# EAGLE design T08_rc360detector_final (EAGLE 7.4.0)
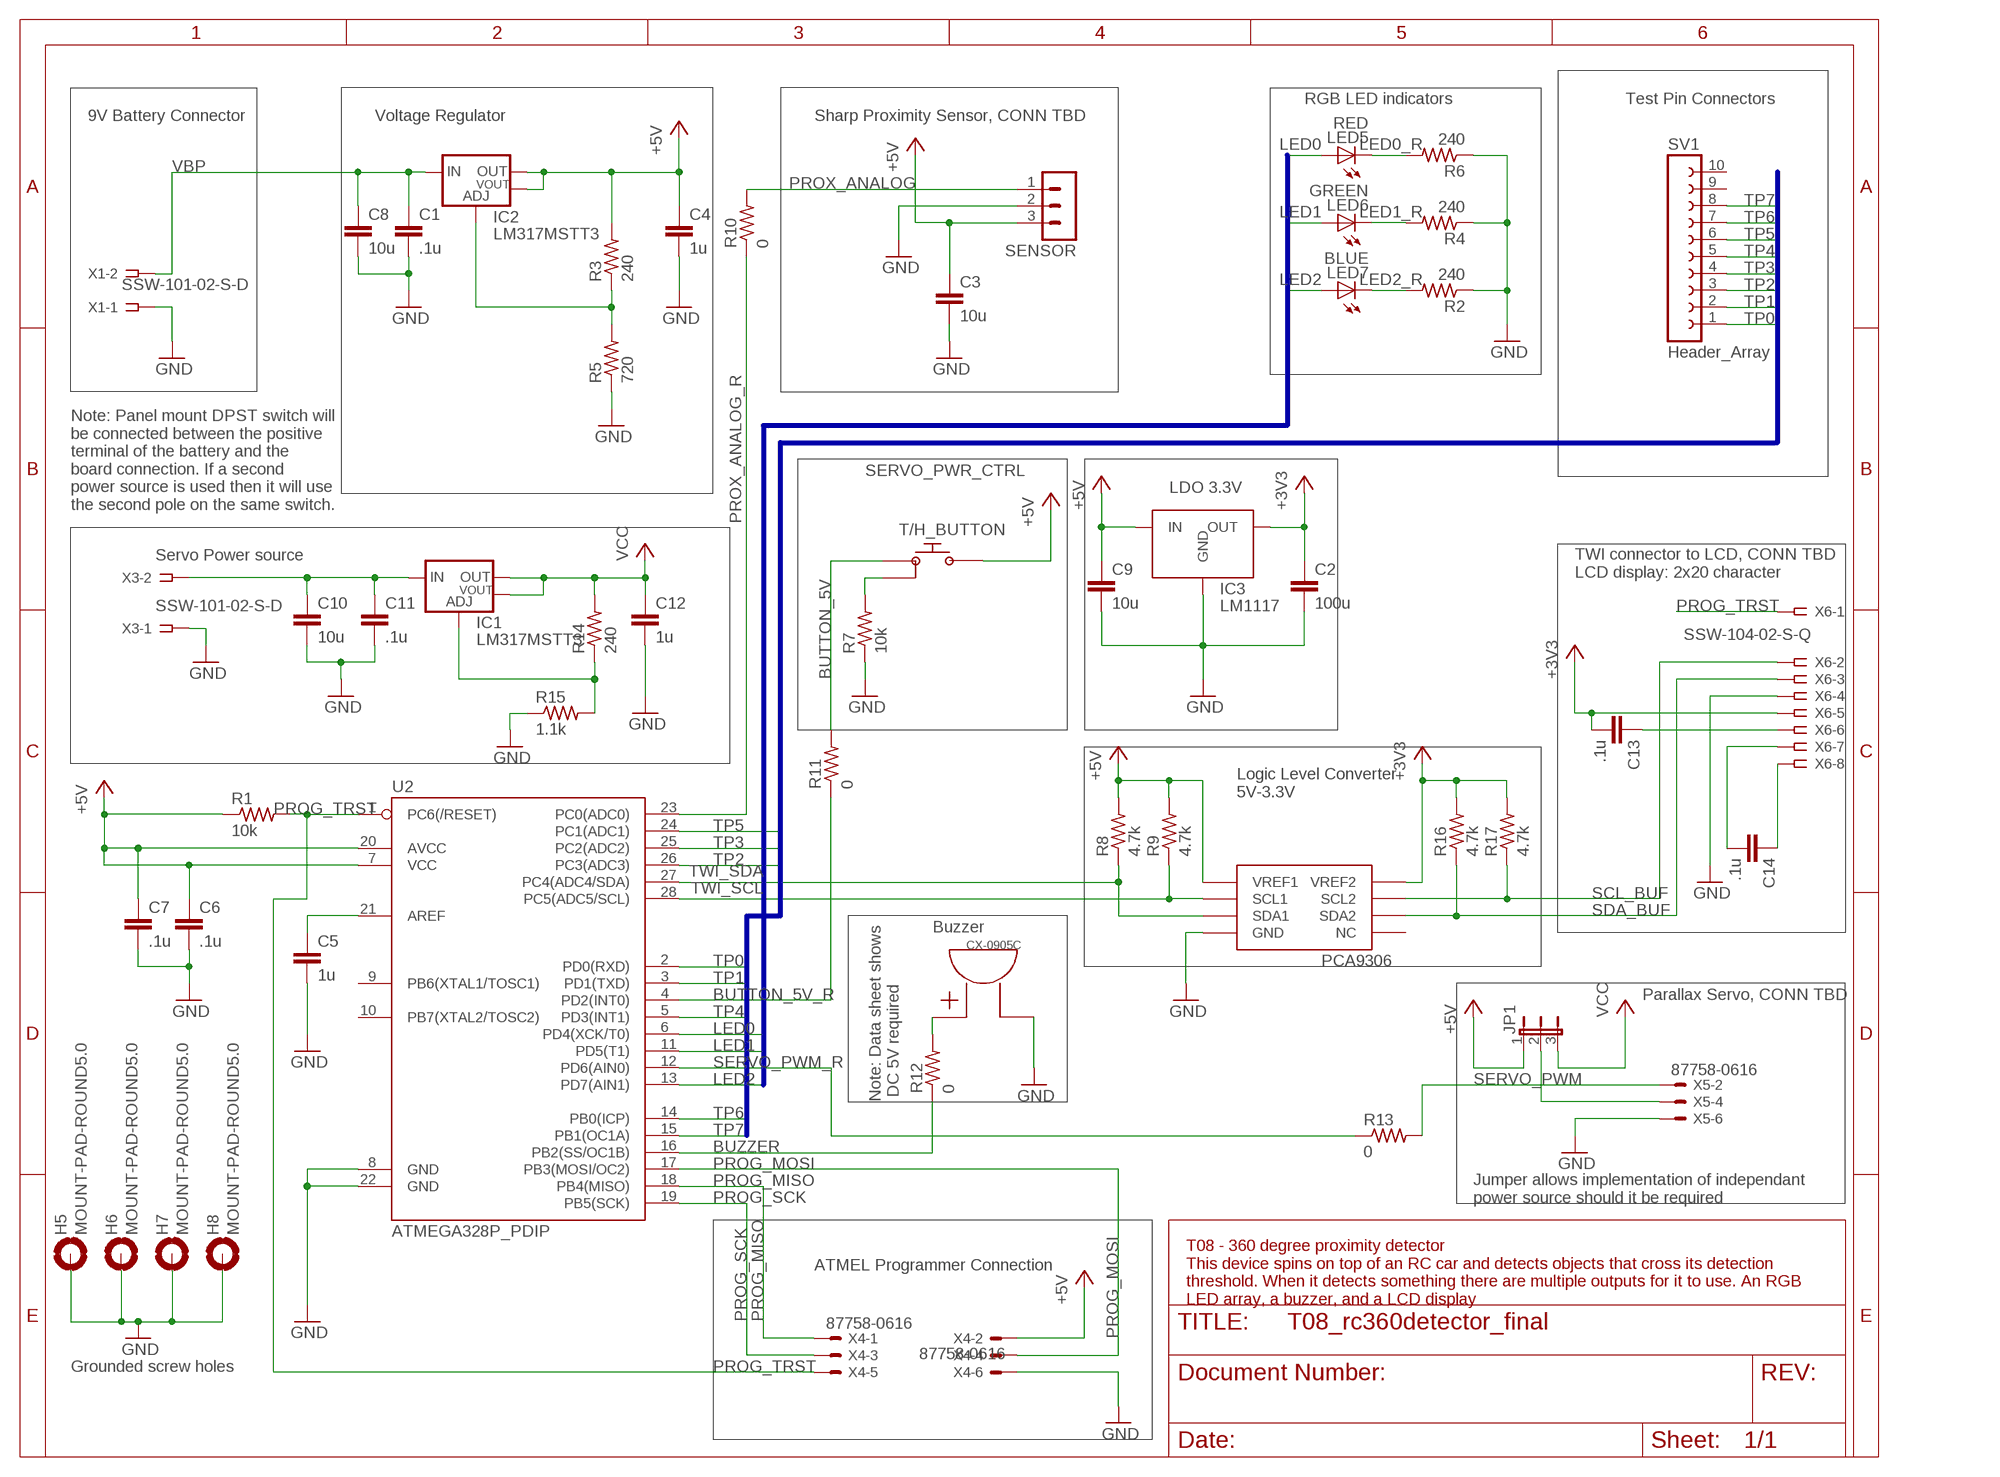
[diagram p0: schematic, sheet 1]

## Parts
C1  .1u  C-EUC0805  [C0805]
C2  100u  C-EUC0805  [C0805]
C3  10u  C-EUC0805  [C0805]
C4  1u  C-EUC0805  [C0805]
C5  1u  C-EUC0805  [C0805]
C6  .1u  C-EUC0805  [C0805]
C7  .1u  C-EUC0805  [C0805]
C8  10u  C-EUC0805  [C0805]
C9  10u  C-EUC0805  [C0805]
C10  10u  C-EUC0805  [C0805]
C11  .1u  C-EUC0805  [C0805]
C12  1u  C-EUC0805  [C0805]
C13  .1u  C-EUC0805  [C0805]
C14  .1u  C-EUC0805  [C0805]
CX-0905C  CX-0905C  [BUZZER_CX-0905C]
H5  MOUNT-PAD-ROUND5.0  [5,0-PAD]
H6  MOUNT-PAD-ROUND5.0  [5,0-PAD]
H7  MOUNT-PAD-ROUND5.0  [5,0-PAD]
H8  MOUNT-PAD-ROUND5.0  [5,0-PAD]
IC1  LM317MSTT3  [SOT223]
IC2  LM317MSTT3  [SOT223]
IC3  LM1117  [SOT-223]
JP1  JP2E  [JP2]
LED5  RED  LEDLD260  [LD260]
LED6  GREEN  LEDLD260  [LD260]
LED7  BLUE  LEDLD260  [LD260]
PCA9306  PCA9306_BREAKOUT  [PCA9306_BREAKOUT]
R1  10k  R-US_R0805  [R0805]
R2  240  R-US_R0805  [R0805]
R3  240  R-US_R0805  [R0805]
R4  240  R-US_R0805  [R0805]
R5  720  R-US_R0805  [R0805]
R6  240  R-US_R0805  [R0805]
R7  10k  R-US_R0805  [R0805]
R8  4.7k  R-US_R0805  [R0805]
R9  4.7k  R-US_R0805  [R0805]
R10  0  R-US_R0805  [R0805]
R11  0  R-US_R0805  [R0805]
R12  0  R-US_R0805  [R0805]
R13  0  R-US_R0805  [R0805]
R14  240  R-US_R0805  [R0805]
R15  1.1k  R-US_R0805  [R0805]
R16  4.7k  R-US_R0805  [R0805]
R17  4.7k  R-US_R0805  [R0805]
SENSOR  MA03-1  [MA03-1]
SV1  Header_Array  FE10-1  [FE10]
T/H_BUTTON  PR141C  [3_THROUGH_HOLE]
U2  ATMEGA328P_PDIP  [DIL28-3]
X1  SSW-101-02-S-D  [SSW-101-02-S-D]
X3  SSW-101-02-S-D  [SSW-101-02-S-D]
X4  87758-0616  [87758-0616]
X5  87758-0616  [87758-0616]
X6  SSW-104-02-S-Q  [SSW-104-02-S-Q]

## Nets
+3V3: C2.1 C13.2 IC3.VOUT(OUT) PCA9306.VREF2 R16.2 R17.2 X6.5
+5V: C3.1 C4.1 C6.1 C7.1 C9.1 IC2.2(VOUT) IC2.4(OUT) IC3.IN JP1.1 PCA9306.VREF1 R1.1 R3.2 R8.2 R9.2 SENSOR.3 T/H_BUTTON.P$3(OUT) U2.7(VCC) U2.20(AVCC) X4.2
AREF: C5.1 U2.21(AREF)
BUTTON_5V: R11.2 T/H_BUTTON.P$1(IN)
BUTTON_5V_R: R11.1 U2.4(PD2(INT0))
BUZZER: R12.1 U2.16(PB2(SS/OC1B))
GND: C1.2 C2.2 C3.2 C4.2 C5.2 C6.2 C7.2 C8.2 C9.2 C10.2 C11.2 C12.2 CX-0905C.OUT H5.B5(MOUNT) H6.B5(MOUNT) H7.B5(MOUNT) H8.B5(MOUNT) IC3.GND PCA9306.GND R2.1 R4.1 R5.1 R6.1 R7.1 R15.1 SENSOR.2 U2.8(GND) U2.22(GND) X1.1 X3.1 X4.6 X5.6 X6.4
LED0: LED5.A U2.6(PD4(XCK/T0))
LED0_R: LED5.K(C) R6.2
LED1: LED6.A U2.11(PD5(T1))
LED1_R: LED6.K(C) R4.2
LED2: LED7.A U2.13(PD7(AIN1))
LED2_R: LED7.K(C) R2.2
N$1: R7.2 T/H_BUTTON.P$2(GND)
N$2: IC2.1(ADJ) R3.1 R5.2
N$4: CX-0905C.IN R12.2
N$13: IC1.1(ADJ) R14.1 R15.2
N$14: C10.1 C11.1 IC1.3(IN) X3.2
N$16: JP1.2 X5.4
N$18: C13.1 X6.6
N$19: C14.2 X6.7
N$20: C14.1 X6.8
PROG_MISO: U2.18(PB4(MISO)) X4.1
PROG_MOSI: U2.17(PB3(MOSI/OC2)) X4.4
PROG_SCK: U2.19(PB5(SCK)) X4.3
PROG_TRST: R1.2 U2.1(PC6(/RESET)) X4.5 X6.1
PROX_ANALOG: R10.2 SENSOR.1
PROX_ANALOG_R: R10.1 U2.23(PC0(ADC0))
SCL_BUF: PCA9306.SCL2 R17.1 X6.2
SDA_BUF: PCA9306.SDA2 R16.1 X6.3
SERVO_PWM: R13.2 X5.2
SERVO_PWM_R: R13.1 U2.12(PD6(AIN0))
TP0: SV1.1 U2.2(PD0(RXD))
TP1: SV1.2 U2.3(PD1(TXD))
TP2: SV1.3 U2.26(PC3(ADC3))
TP3: SV1.4 U2.25(PC2(ADC2))
TP4: SV1.5 U2.5(PD3(INT1))
TP5: SV1.6 U2.24(PC1(ADC1))
TP6: SV1.7 U2.14(PB0(ICP))
TP7: SV1.8 U2.15(PB1(OC1A))
TWI_SCL: PCA9306.SCL1 R9.1 U2.28(PC5(ADC5/SCL))
TWI_SDA: PCA9306.SDA1 R8.1 U2.27(PC4(ADC4/SDA))
VBP: C1.1 C8.1 IC2.3(IN) X1.2
VCC: C12.1 IC1.2(VOUT) IC1.4(OUT) JP1.3 R14.2
Unconnected: PCA9306.NC SV1.9 SV1.10 U2.9(PB6(XTAL1/TOSC1)) U2.10(PB7(XTAL2/TOSC2)) X5.1 X5.3 X5.5

## Buses
LED[0..2]
TP[0..13]

## Notes on the sheet
- RGB LED indicators | Test Pin Connectors
- 9V Battery Connector | Voltage Regulator | Sharp Proximity Sensor, CONN TBD
- SERVO_PWR_CTRL
- LDO 3.3V
- Note: Panel mount DPST switch will
  be connected between the positive
  terminal of the battery and the 
  board connection. If a second 
  power source is used then it will use
  the second pole on the same switch.
- Servo Power source
- TWI connector to LCD, CONN TBD
  LCD display: 2x20 character
- Logic Level Converter
  5V-3.3V
- Buzzer
- Parallax Servo, CONN TBD
- Note: Data sheet shows
   DC 5V required
- Jumper allows implementation of independant 
  power source should it be required
- ATMEL Programmer Connection
- T08 - 360 degree proximity detector
  This device spins on top of an RC car and detects objects that cross its detection
  threshold. When it detects something there are multiple outputs for it to use. An RGB 
  LED array, a buzzer, and a LCD display
- Grounded screw holes

## Library data of the parts
C1 C4 C5 C9 C11-C14 = resistor:C-EU: CAPACITOR, European symbol
C2 C3 C6-C8 C10 = rcl:C-EU: CAPACITOR, European symbol
CX-0905C = 360prox:CX-0905C
H5-H8 = holes:MOUNT-PAD-ROUND: MOUNTING PAD, round
IC1 IC2 = v-reg:LM317?*: 500 mA Adjustable Output Positive Voltage Regulator Source: http://www.onsemi.co.jp .. LM317M-D.PDF
IC3 = 360prox:LM1117
JP1 = jumper:JP2E: JUMPER
LED5-LED7 = led:LED: LED OSRAM: - CHIPLED LG R971, LG N971, LY N971, LG Q971, LY Q971, LO R971, LY R971 LH N974, LH R974 LS Q976, LO Q976, LY Q976 LO Q996 - Hyper CHIPLED LW Q18S LB Q993, LB Q99A, LB R99A - SideLED LS A670, LO A670, LY A670, LG A670, LP A670 LB A673, LV A673, LT A673, LW A673 LH A674 LY A675 LS A676, LA A676, LO A676, LY A676, LW A676 LS A679, LY A679, LG A679 - Hyper Micro SIDELED® LS Y876, LA Y876, LO Y876, LY Y876 LT Y87S - SmartLED LW L88C, LW L88S LB L89C, LB L89S, LG L890 LS L89K, LO L89K, LY L89K LS L896, LA L896, LO L896, LY L896 - TOPLED LS T670, LO T670, LY T670, LG T670, LP T670 LSG T670, LSP T670, LSY T670, LOP T670, LYG T670 LG T671, LOG T671, LSG T671 LB T673, LV T673, LT T673, LW T673 LH T674 LS T676, LA T676, LO T676, LY T676, LB T676, LH T676, LSB T676, LW T676 LB T67C, LV T67C, LT T67C, LS T67K, LO T67K, LY T67K, LW E67C LS E67B, LA E67B, LO E67B, LY E67B, LB E67C, LV E67C, LT E67C LW T67C LS T679, LY T679, LG T679 LS T770, LO T770, LY T770, LG T770, LP T770 LB T773, LV T773, LT T773, LW T773 LH T774 LS E675, LA E675, LY E675, LS T675 LS T776, LA T776, LO T776, LY T776, LB T776 LHGB T686 LT T68C, LB T68C - Hyper Mini TOPLED® LB M676 - Mini TOPLED Santana® LG M470 LS M47K, LO M47K, LY M47K Source: http://www.osram.convergy.de LUXEON: - LUMILED® LXK2-PW12-R00, LXK2-PW12-S00, LXK2-PW14-U00, LXK2-PW14-V00 LXK2-PM12-R00, LXK2-PM12-S00, LXK2-PM14-U00 LXK2-PE12-Q00, LXK2-PE12-R00, LXK2-PE12-S00, LXK2-PE14-T00, LXK2-PE14-U00 LXK2-PB12-K00, LXK2-PB12-L00, LXK2-PB12-M00, LXK2-PB14-N00, LXK2-PB14-P00, LXK2-PB14-Q00 LXK2-PR12-L00, LXK2-PR12-M00, LXK2-PR14-Q00, LXK2-PR14-R00 LXK2-PD12-Q00, LXK2-PD12-R00, LXK2-PD12-S00 LXK2-PH12-R00, LXK2-PH12-S00 LXK2-PL12-P00, LXK2-PL12-Q00, LXK2-PL12-R00 Source: www.luxeon.com KINGBRIGHT: KA-3528ASYC Source: www.kingbright.com
PCA9306 = 360prox:PCA9306_BREAKOUT
R1-R17 = rcl:R-US_: RESISTOR, American symbol
SENSOR = con-lstb:MA03-1: PIN HEADER; OC_FARNELL: unknown; OC_NEWARK: unknown
SV1 = con-lsta:FE10-1: FEMALE HEADER; OC_FARNELL: unknown; OC_NEWARK: unknown
T/H_BUTTON = 360prox:PR141C
U2 = SparkFun-DigitalIC:ATMEGA328P_PDIP: uC used in the Arduino 32kb flash, 1k EEPROM, 2k SRAM This is the through-hole version of this chip.
X1 X3 = con-samtec:SSW-101-02-S-D: THROUGH-HOLE .025" SQ POST SOCKET Source: Samtec SSW.pdf; MPN: SSW-101-02-S-D; OC_FARNELL: unknown; OC_NEWARK: 82P1456
X4 X5 = con-molex:87758-0616: 6 Pin - 2mm Dual Row Single Wafer, Vertical T/H HDR Source: http://www.molex.com/pdm_docs/sd/877580616_sd.pdf; MPN: 87758-0616; OC_FARNELL: 7472323; OC_NEWARK: 25M5667
X6 = con-samtec:SSW-104-02-S-Q: THROUGH-HOLE .025" SQ POST SOCKET Source: Samtec SSW.pdf; MPN: SSW-104-02-S-Q; OC_FARNELL: unknown; OC_NEWARK: 82P2475

## Board
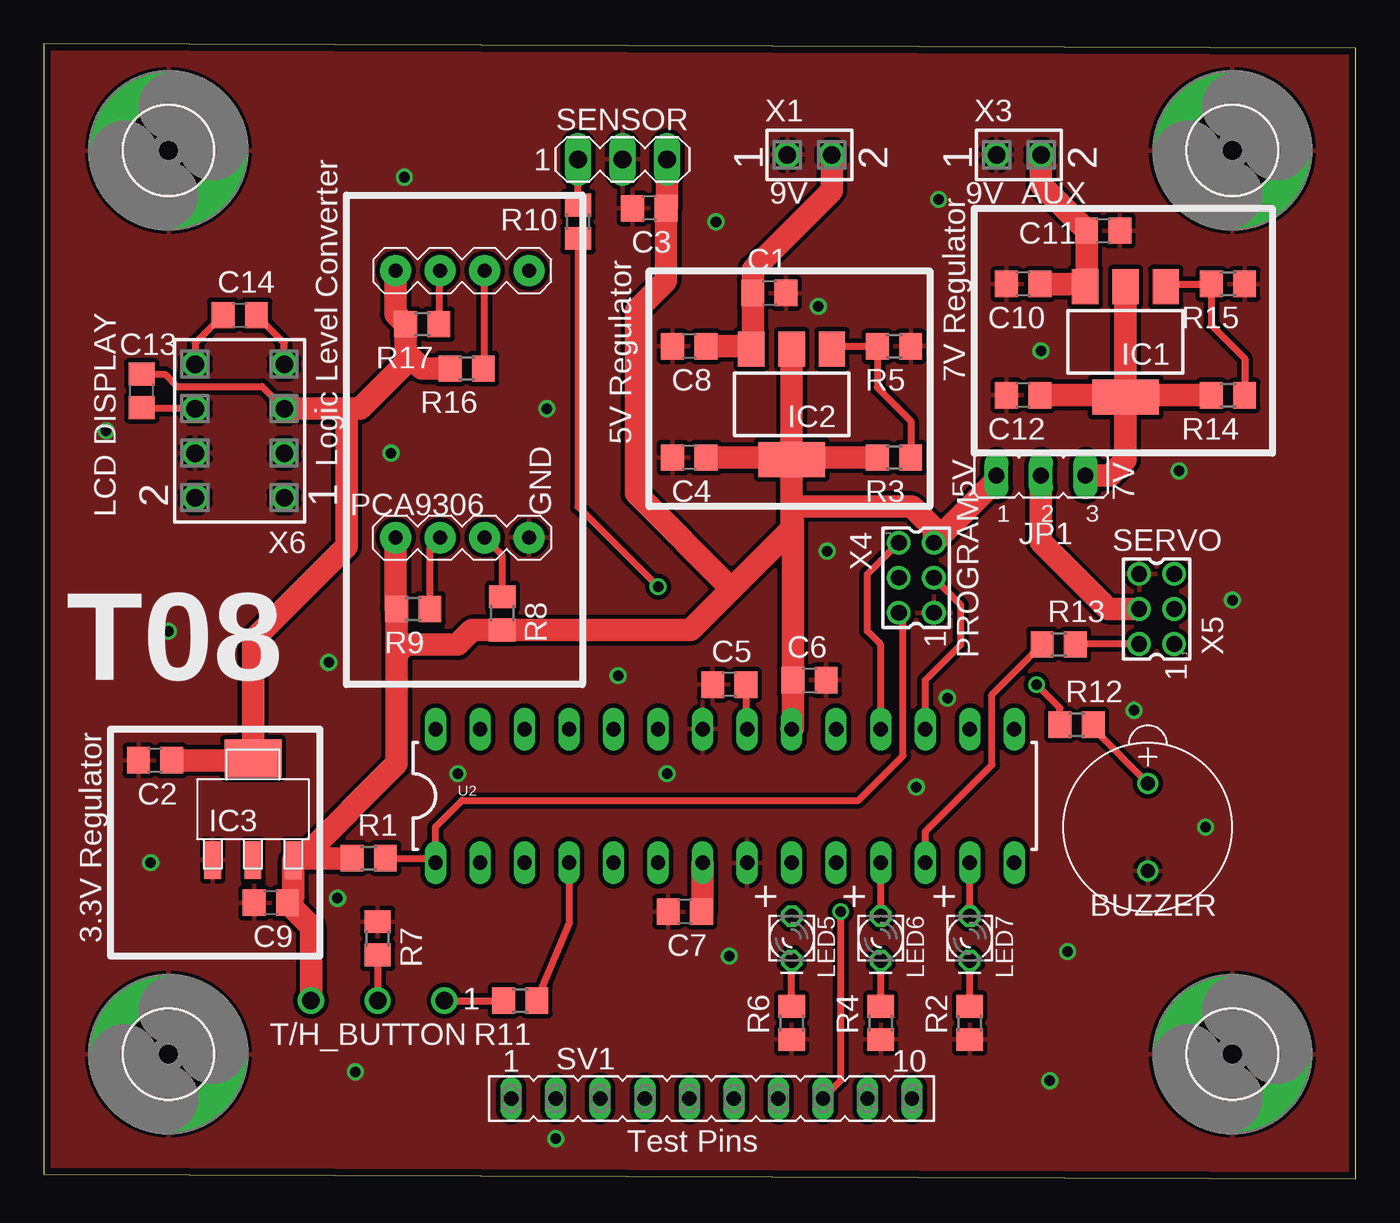
[diagram p1: board, top side]
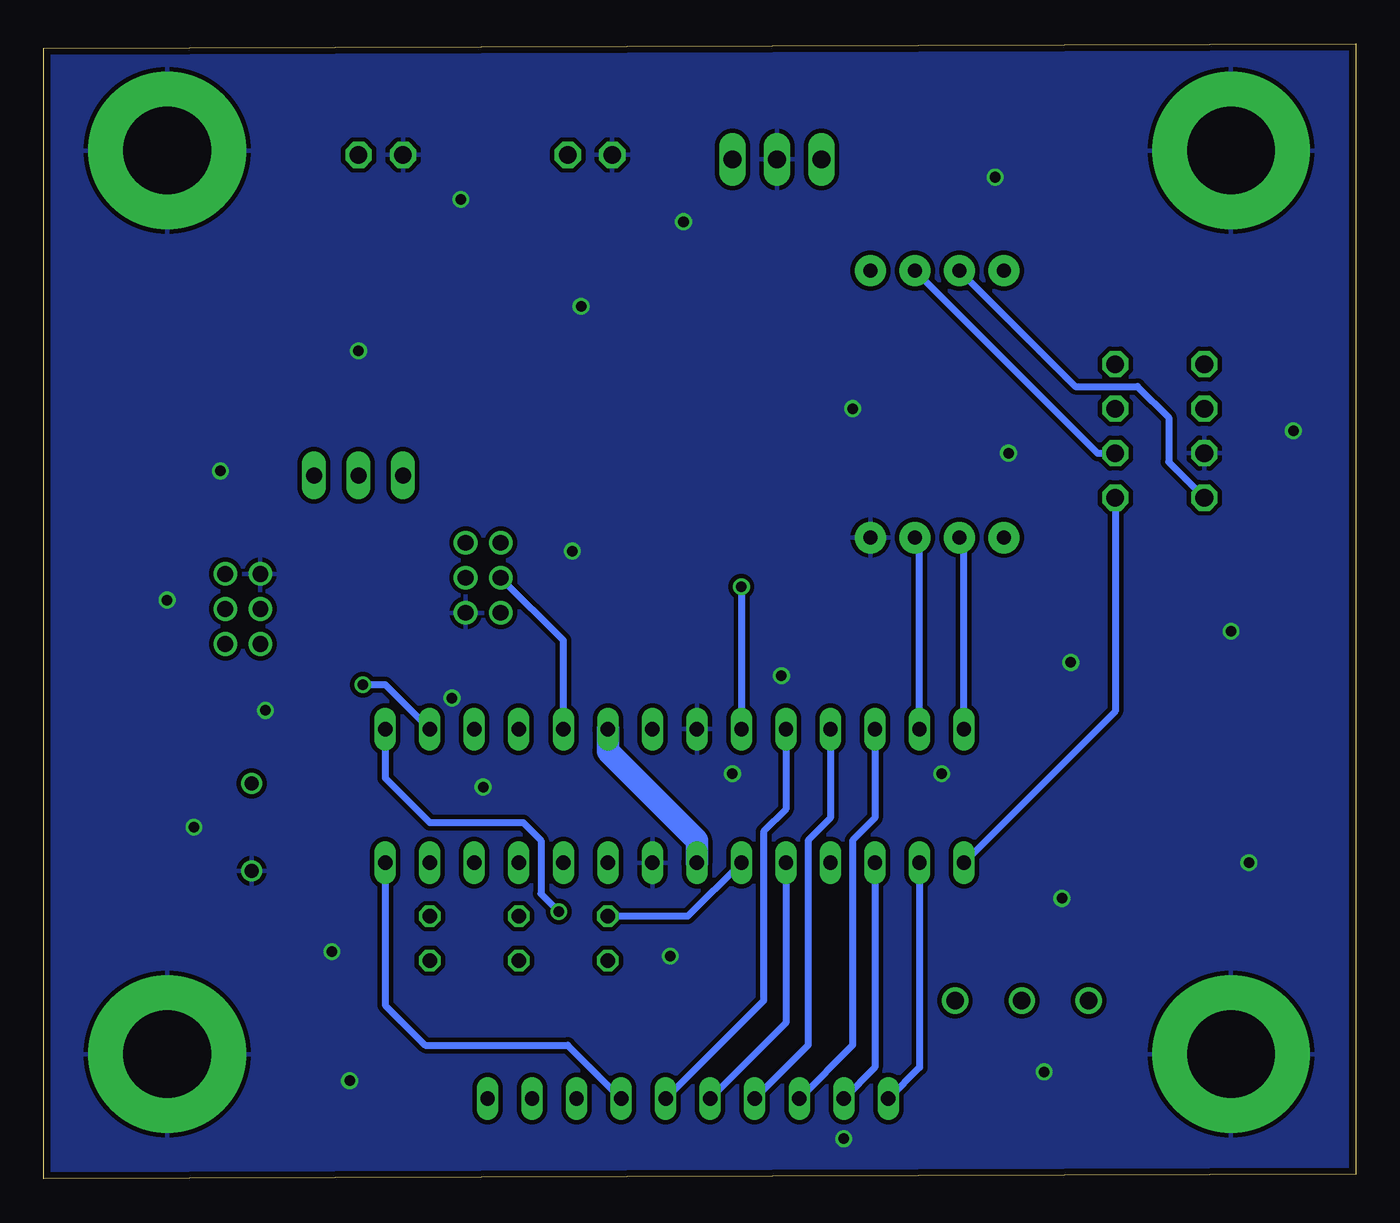
[diagram p2: board, bottom side, seen from below]

Size 74.85 x 64.76 mm. Coordinates in mm from the lower left corner, seen from the top.
Outline: 0,0.25 74.85,0 74.85,64.51 0,64.76 0,0.25
Copper layers (1*16): Top 0.0356mm / dielectric 1.5011mm / Bottom 0.0356mm
Design rules "OSH-Park-2-layer": minimum track width 6mil, minimum drill 13mil, track to track 6mil, track to pad 6mil, pad to pad 6mil, via to via 6mil, smd to smd 6mil, copper to edge 15mil, drill to drill 6mil, minimum pad ring 7mil, minimum via ring 7mil, stop-mask expansion 3mil, vias tented up to drill 0mil, thermal gap 10mil

### Footprints (pad centres in the part's own frame; a part is rotated, then mirrored left to right if it is on the bottom)
C0805 = smd 1.3 x 1.5: 1 -0.95,0; 2 0.95,0
BUZZER_CX-0905C = drill 0.8: IN 0,2.5; OUT 0,-2.5
5,0-PAD = drill 5 pad 9: B5 0,0
SOT223 = smd 1.5 x 2: 1 -2.3,-3.15; 2 0,-3.15; 3 2.3,-3.15 | smd 3.8 x 2: 4 0,3.15
SOT-223 = smd 0.95 x 2.15: GND -2.3,-2.9; IN 2.3,-2.9; OUT 0,-2.9 | smd 3.25 x 2.15: VOUT 0,2.9
JP2 = drill 0.914 long: 1 -2.54,0; 2 0,0; 3 2.54,0
LD260 = drill 0.813 octagon: A -1.27,0; K 1.27,0
PCA9306_BREAKOUT = drill 0.8 pad 1.778: GND 1.27,1.27; NC 16.51,1.27; SCL1 1.27,6.35; SCL2 16.51,6.35; SDA1 1.27,3.81; SDA2 16.51,3.81; VREF1 1.27,8.89; VREF2 16.51,8.89
R0805 = smd 1.3 x 1.5: 1 -0.95,0; 2 0.95,0
MA03-1 = drill 1.016 long: 1 -2.54,0; 2 0,0; 3 2.54,0
FE10 = drill 0.813 long: 1 -11.43,0; 2 -8.89,0; 3 -6.35,0; 4 -3.81,0; 5 -1.27,0; 6 1.27,0; 7 3.81,0; 8 6.35,0; 9 8.89,0; 10 11.43,0
3_THROUGH_HOLE = drill 1: P$1 0,0; P$2 3.81,0; P$3 7.62,0
DIL28-3 = drill 0.813 long: 1 -16.51,-3.81; 2 -13.97,-3.81; 3 -11.43,-3.81; 4 -8.89,-3.81; 5 -6.35,-3.81; 6 -3.81,-3.81; 7 -1.27,-3.81; 8 1.27,-3.81; 9 3.81,-3.81; 10 6.35,-3.81; 11 8.89,-3.81; 12 11.43,-3.81; 13 13.97,-3.81; 14 16.51,-3.81; 15 16.51,3.81; 16 13.97,3.81; 17 11.43,3.81; 18 8.89,3.81; 19 6.35,3.81; 20 3.81,3.81; 21 1.27,3.81; 22 -1.27,3.81; 23 -3.81,3.81; 24 -6.35,3.81; 25 -8.89,3.81; 26 -11.43,3.81; 27 -13.97,3.81; 28 -16.51,3.81
SSW-101-02-S-D = drill 1 pad 1.5 octagon: 1 0,-1.27; 2 0,1.27
87758-0616 = drill 0.9 pad 1.27: 1 -2,-1; 2 -2,1; 3 0,-1; 4 0,1; 5 2,-1; 6 2,1
SSW-104-02-S-Q = drill 1 pad 1.5 octagon: 1 -3.81,-2.54; 2 -3.81,2.54; 3 -1.27,-2.54; 4 -1.27,2.54; 5 1.27,-2.54; 6 1.27,2.54; 7 3.81,-2.54; 8 3.81,2.54

### Placement (x,y rotation side)
C1  41.4,50.55 0 top
C2  6.35,23.88 180 top
C3  34.54,55.37 180 top
C4  36.83,41.15 180 top
C5  39.12,28.19 180 top
C6  43.69,28.45 0 top
C7  36.58,15.24 180 top
C8  36.83,47.5 180 top
C9  12.95,15.75 180 top
C10  55.88,51.05 180 top
C11  60.45,54.1 0 top
C12  55.88,44.7 180 top
C13  5.59,44.96 90 top
C14  11.18,49.28 0 top
CX-0905C  62.99,20.07 0 top
H5  7.11,7.11 0 top
H6  67.82,7.11 0 top
H7  67.82,58.67 0 top
H8  7.11,58.67 0 top
IC1  61.72,47.75 180 top
IC2  42.67,44.2 180 top
IC3  11.94,21.08 0 top
JP1  56.9,40.13 0 top
LED5  42.67,13.72 270 top
LED6  47.75,13.72 270 top
LED7  52.83,13.72 270 top
PCA9306  28.96,35.31 90 top
R1  18.54,18.29 0 top
R2  52.83,8.89 90 top
R3  48.51,41.15 180 top
R4  47.75,8.89 90 top
R5  48.51,47.5 180 top
R6  42.67,8.89 90 top
R7  19.05,13.72 270 top
R8  26.16,32.26 270 top
R9  21.08,32.51 180 top
R10  30.48,54.61 90 top
R11  27.18,10.16 180 top
R12  58.93,25.91 0 top
R13  57.91,30.48 0 top
R14  67.56,44.7 180 top
R15  67.56,51.05 180 top
R16  24.13,46.23 180 top
R17  21.59,48.77 180 top
SENSOR  33.02,58.17 0 top
SV1  38.1,4.57 0 top
T/H_BUTTON  22.86,10.16 180 top
U2  38.86,21.84 0 top
X1  43.69,58.42 270 top
X3  55.63,58.42 270 top
X4  49.78,34.29 270 top
X5  63.5,32.51 90 top
X6  11.18,42.67 90 top

### Tracks (layer width: path | path; a pad name or v marks a point on that pad's centre or on a via)
+3V3
  Top 0.406: C13.2 6.92,45.91 7.62,45.21 12.45,45.21 X6.5
  Top 1.27: C2.1 11.83,23.88 IC3.VOUT 11.94,30.73 17.27,36.07 17.27,43.94 | PCA9306.VREF2 20.07,49.34 R17.2 20.64,47.18 20.95,46.86 | 20.95,46.86 21.59,46.23 R16.2 | X6.5 17.27,43.94 | 17.27,43.94 18.03,43.94 20.95,46.86
+5V
  Top 1.27: IC2.2 IC2.4 | U2.7 37.59,15.31 C7.1 | T/H_BUTTON.P$3 15.24,14.41 C9.1 14.24,16.08 IC3.IN 14.34,18.29 14.73,18.29 | 14.73,18.29 R1.1 | PCA9306.VREF1 20.07,32.58 R9.2 20.13,29.97 | 20.13,29.97 20.13,23.69 14.73,18.29 | 20.13,29.97 20.64,30.48 23.62,30.48 24.45,31.31 R8.2 36.9,31.31 39.24,33.66 | U2.20 42.74,25.72 C6.1 42.74,37.53 42.67,37.59 | R3.2 44.2,41.15 43.94,40.89 42.82,40.89 IC2.4 | C4.1 42.57,41.15 IC2.4 | 39.24,33.66 42.67,37.08 42.67,37.59 | 42.67,37.59 42.67,38.1 | 42.67,38.1 IC2.4 | JP1.1 54.36,39.86 X4.2 50.78,37.1 49.53,38.35 42.93,38.35 42.67,38.1 | SENSOR.3 35.56,55.44 C3.1 35.49,51.24 33.78,49.53 33.78,39.12 39.24,33.66
  Bottom 1.27: U2.20 42.67,24.38 37.59,19.3 U2.7
AREF
  Top 0.406: C5.1 40.07,25.72 U2.21
BUTTON_5V
  Top 0.406: T/H_BUTTON.P$1 R11.2
BUTTON_5V_R
  Top 0.406: U2.4 29.97,14.54 R11.1
BUZZER  (via drill 0.6)
  Top 0.406: R12.1 57.98,26.86 v56.64,28.19
  Bottom 0.406: v56.64,28.19 55.37,28.19 U2.16
GND  (via drill 0.6)
  other vias: 28.7,43.94 3.56,42.67 6.1,18.03 17.78,6.1 29.21,2.29 57.4,5.59 62.2,26.72 66.29,20.07 44.2,49.78 7.11,31.24 51.56,27.43 44.7,35.81 32.77,28.7 16.26,29.46 35.56,23.11 39.12,12.7 49.78,22.35 58.42,12.95 23.62,23.11 16.76,16 19.81,41.4 20.57,57.15 38.35,54.61 51.05,55.88 56.9,47.24 64.77,40.39 67.82,33.02
  pour Top (isolate 0.254): 0,0.25 74.68,0 74.68,64.26 0,64.52
  pour Bottom (isolate 0.254): 0,0.25 74.68,0 74.68,64.26 0,64.52
LED0
  Bottom 0.406: LED5.A 38.1,14.99 U2.6
LED0_R
  Top 0.406: R6.2 LED5.K
LED1
  Top 0.406: LED6.A U2.11
LED1_R
  Top 0.406: R4.2 LED6.K
LED2
  Top 0.406: LED7.A U2.13
LED2_R
  Top 0.406: R2.2 LED7.K
N$1
  Top 0.406: R7.2 T/H_BUTTON.P$2
N$2
  Top 0.406: IC2.1 45.12,47.5 R5.2 47.56,45.15 49.46,43.25 R3.1
N$4
  Top 0.406: R12.2 59.88,25.68 CX-0905C.IN
N$13
  Top 0.406: 64.17,51.05 R15.2 66.61,48.7 68.51,46.8 R14.1
  Top 1.27: IC1.1 64.17,51.05
N$14
  Top 1.27: C10.1 59.27,51.05 IC1.3 59.5,50.98 C11.1 56.9,56.71 X3.2
N$16
  Top 1.27: X5.4 60.71,32.51 56.9,36.32 JP1.2
N$18
  Top 0.406: X6.6 5.65,43.94 C13.1
N$19
  Top 0.406: X6.7 13.72,47.69 C14.2
N$20
  Top 0.406: C14.1 8.64,47.69 X6.8
PROG_MISO
  Top 0.406: U2.18 47.75,30.48 46.99,31.24 46.99,34.5 X4.1
PROG_MOSI
  Top 0.406: U2.17 50.29,28.45 52.32,30.48 52.32,32.75 X4.4
PROG_SCK
  Bottom 0.406: U2.19 45.21,30.72 X4.3
PROG_TRST
  Top 0.406: R1.2 22.1,18.29 U2.1 22.35,20.07 23.88,21.59 46.48,21.59 49.02,24.13 49.02,32.05 X4.5
  Bottom 0.406: X6.1 13.72,26.67 U2.1
PROX_ANALOG
  Top 0.406: R10.2 SENSOR.1
PROX_ANALOG_R  (via drill 0.6)
  Top 0.406: R10.1 30.48,38.35 v35.05,33.78
  Bottom 0.406: v35.05,33.78 U2.23
SCL_BUF
  Top 0.406: PCA9306.SCL2 22.54,51.75 R17.1
  Bottom 0.406: PCA9306.SCL2 16,45.21 12.45,45.21 10.67,43.43 10.67,40.89 X6.2
SDA_BUF
  Top 0.406: R16.1 25.15,46.29 PCA9306.SDA2
  Bottom 0.406: PCA9306.SDA2 14.73,41.4 X6.3
SERVO_PWM
  Top 0.406: X5.2 58.89,30.51 R13.2
SERVO_PWM_R
  Top 0.406: U2.12 50.29,19.81 54.1,23.62 54.1,27.62 R13.1
TP0
  Bottom 0.406: U2.2 24.89,6.35 SV1.1
TP1
  Bottom 0.406: U2.3 27.43,6.35 SV1.2
TP2
  Bottom 0.406: U2.26 27.43,20.57 28.7,19.3 28.7,7.62 SV1.3
TP3
  Bottom 0.406: U2.25 29.97,20.57 31.24,19.3 31.24,7.62 SV1.4
TP4
  Bottom 0.406: U2.5 32.51,8.89 SV1.5
TP5
  Bottom 0.406: U2.24 32.51,21.08 33.78,19.81 33.78,10.16 SV1.6
TP6
  Bottom 0.406: U2.14 55.37,9.91 53.09,7.62 44.96,7.62 SV1.7
TP7  (via drill 0.6)
  Top 0.406: v45.47,15.24 45.47,5.59 SV1.8
  Bottom 0.406: U2.15 55.37,22.86 52.83,20.32 47.5,20.32 46.48,19.3 46.48,16.26 v45.47,15.24
TWI_SCL
  Top 0.406: R9.1 22.03,36 PCA9306.SCL1
  Bottom 0.406: U2.28 22.35,36.32 PCA9306.SCL1
TWI_SDA
  Top 0.406: R8.1 26.16,35.56 PCA9306.SDA1
  Bottom 0.406: U2.27 24.89,36.32 PCA9306.SDA1
VBP
  Top 1.27: C8.1 40.22,47.5 IC2.3 40.45,47.43 C1.1 40.45,51.88 44.96,56.39 X1.2
VCC
  Top 1.27: IC1.4 61.82,44.7 R14.2 | IC1.4 61.62,44.7 C12.1 | IC1.2 IC1.4 | IC1.4 61.72,41.02 60.83,40.13 JP1.3

### Text on the board
tPlace: 9V | 9V_AUX | 7V Regulator | 5V Regulator | 7V | Logic Level Converter | 5V | LCD DISPLAY | SERVO | 1 | PROGRAM | 1 | T08 | + | + | + | BUZZER | 3.3V Regulator | Test Pins